# Altium schematic sheet sd-card.SchDoc
size A; SheetNumber: 4; SheetTotal: 4
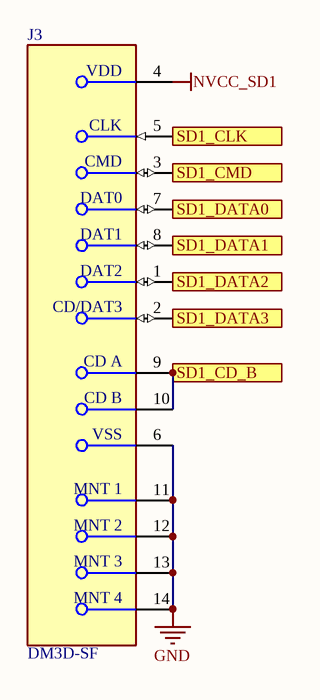
[diagram p0: sd-card.SchDoc]

## Parts
J3  DM3D-SF  [FP-DM3D-SF-MFG]

## Ports
SD1_CD_B, SD1_CLK, SD1_CMD, SD1_DATA0, SD1_DATA1, SD1_DATA2, SD1_DATA3

## Nets
GND: J3.6(VSS) J3.11(MNT_1) J3.12(MNT_2) J3.13(MNT_3) J3.14(MNT_4)
NVCC_SD1: J3.4(VDD)
SD1_CD_B: J3.9(CD_A) J3.10(CD_B) ; port SD1_CD_B
SD1_CLK: J3.5(CLK) ; port SD1_CLK
SD1_CMD: J3.3(CMD) ; port SD1_CMD
SD1_DATA0: J3.7(DAT0) ; port SD1_DATA0
SD1_DATA1: J3.8(DAT1) ; port SD1_DATA1
SD1_DATA2: J3.1(DAT2) ; port SD1_DATA2
SD1_DATA3: J3.2(CD/DAT3) ; port SD1_DATA3

## Library data of the parts
J3 = CMP-2000-06166-2: CONN MICRO SD CARD PUSH-PULL; Insulation Resistance: 1GR; Max Voltage Rating (AC): 125V; Gender: Female; Contact Resistance: 100mR; Current Rating: 500mA; Pitch: 1.1mm; Connector Type: Connector; Number of Contacts: 8; Contact Plating: Gold; Number of Rows: 1; Termination: Solder; Contact Material: Copper Alloy; REACH SVHC: No SVHC; Voltage Rating (AC): 125V; Packaging: Tape and Reel; Housing Material: Polymer; Max Operating Temperature: 85°C; Package Quantity: 1; Min Operating Temperature: -25°C; Lead Free: Lead Free; Orientation: Right Angle; Radiation Hardening: No; Flammability Rating: UL94 V-0; Mount: Surface Mount; Depth: 11.45mm; Max Current Rating: 500mA; Length: 11.95mm; Width: 11.95mm